# EAGLE design NDriveModule (EAGLE 6.5.0)
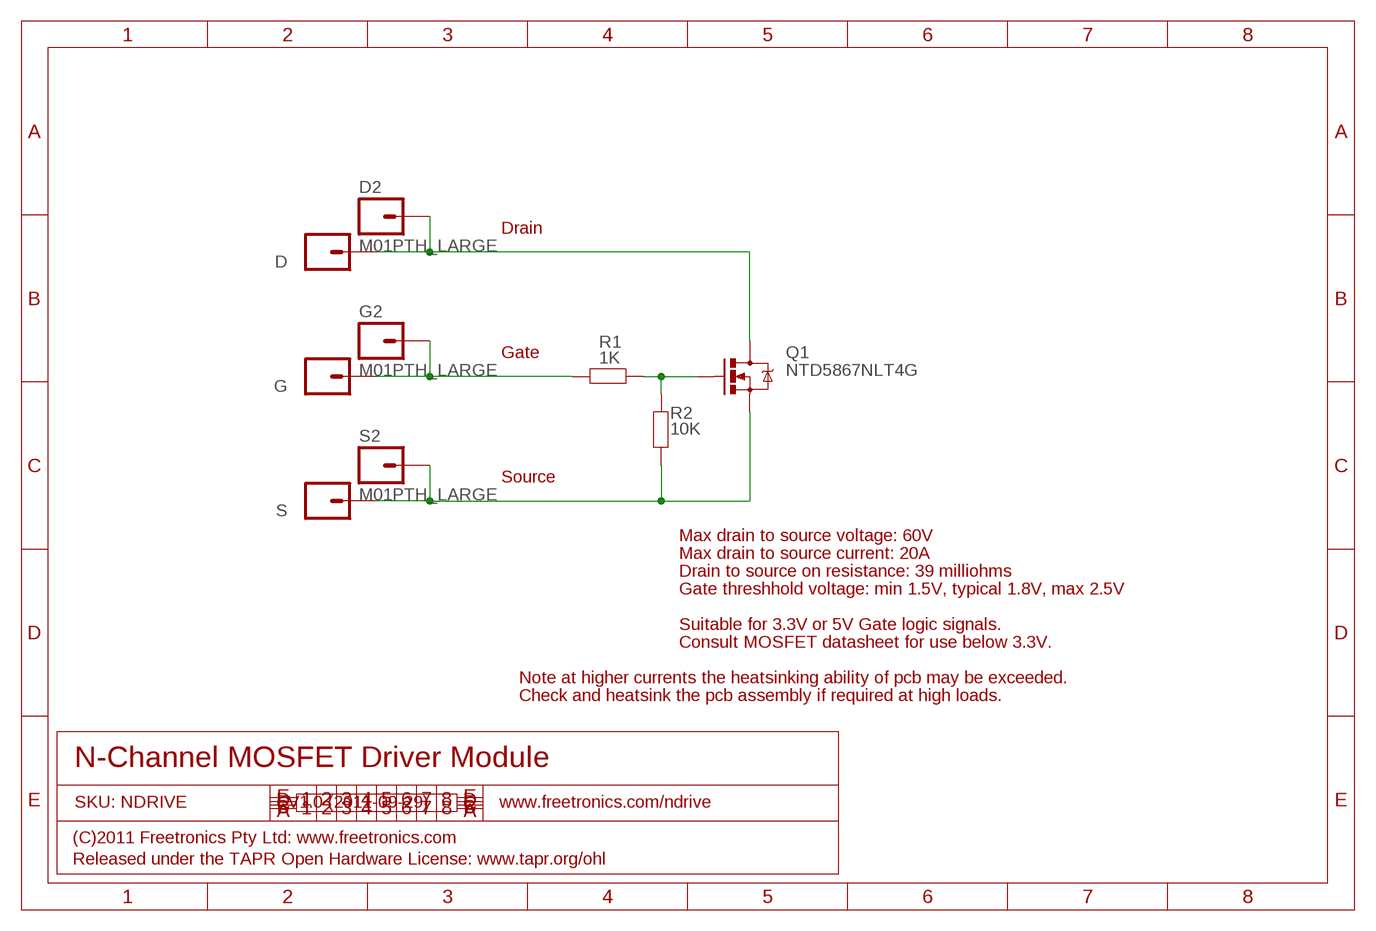
[diagram p0: schematic, sheet 1]

## Parts
D  M01PTH  [1X01]
D2  M01PTH_LARGE  [1X01LARGE]
G  M01PTH  [1X01]
G2  M01PTH_LARGE  [1X01LARGE]
Q1  NTD5867NLT4G  MOSFET-NCHANNELDPAK  [DPACK]
R1  1K  RESISTOR0603  [0603]
R2  10K  RESISTOR0603  [0603]
S  M01PTH  [1X01]
S2  M01PTH_LARGE  [1X01LARGE]

## Nets
D: D2.1 D.1 Q1.2(D)
G: G2.1 G.1 R1.2
N$3: Q1.1(G) R1.1 R2.2
S: Q1.3(S) R2.1 S2.1 S.1

## Notes on the sheet
- Drain
- Gate
- Source
- Max drain to source voltage: 60V
- Max drain to source current: 20A
- Drain to source on resistance: 39 milliohms
- Gate threshhold voltage: min 1.5V, typical 1.8V, max 2.5V
- Suitable for 3.3V or 5V Gate logic signals.
- Consult MOSFET datasheet for use below 3.3V.
- Note at higher currents the heatsinking ability of pcb may be exceeded.
- Check and heatsink the pcb assembly if required at high loads.
- N-Channel MOSFET Driver Module
- SKU: NDRIVE | V1.0 (2011-09-29) | www.freetronics.com/ndrive
- (C)2011 Freetronics Pty Ltd: www.freetronics.com
- Released under the TAPR Open Hardware License: www.tapr.org/ohl

## Library data of the parts
D G S = freetronics-master-v1:M01: Header 1 Standard 1-pin 0.1" header. Use with straight break away headers (SKU : PRT-00116), right angle break away headers (PRT-00553), swiss pins (PRT-00743), machine pins (PRT-00117), and female headers (PRT-00115).
D2 G2 S2 = freetronics-master-v1.1:M01: Header 1 Standard 1-pin 0.1" header. Use with straight break away headers (SKU : PRT-00116), right angle break away headers (PRT-00553), swiss pins (PRT-00743), machine pins (PRT-00117), and female headers (PRT-00115).
Q1 = freetronics-master-v1.1:MOSFET-NCHANNEL
R1 R2 = freetronics-master-v1:RESISTOR: Resistor Basic schematic elements and footprints for 0603, 1206, and PTH 1/10th watt (small) resistors.

## Board
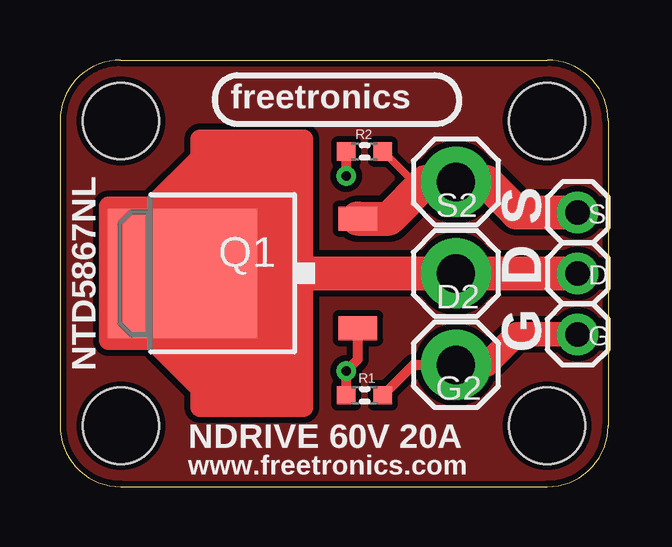
[diagram p1: board, top side]
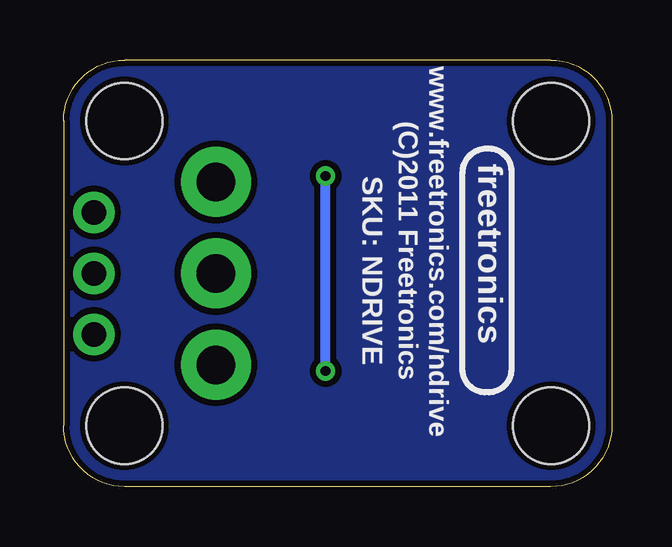
[diagram p2: board, bottom side, seen from below]

Size 22.86 x 17.78 mm. Coordinates in mm from the lower left corner, seen from the top.
Outline: 0,2.54 arc90 2.54,0 20.32,0 arc90 22.86,2.54 22.86,15.24 arc90 20.32,17.78 2.54,17.78 arc90 0,15.24 0,2.54
Copper layers (1*16): Top 0.035mm / dielectric 1.5mm / Bottom 0.035mm
Design rules "default *": minimum track width 8mil, minimum drill 15mil, track to track 10mil, track to pad 10mil, pad to pad 10mil, via to via 10mil, smd to smd 8mil, copper to edge 10mil, drill to drill 8mil, minimum pad ring 14mil, minimum via ring 8mil, stop-mask expansion 4mil, vias tented up to drill 25mil, thermal gap 10mil
Holes 3.17 mm at 2.54,2.54 20.32,2.54 2.54,15.24 20.32,15.24

### Footprints (pad centres in the part's own frame; a part is rotated, then mirrored left to right if it is on the bottom)
1X01 = drill 1.016 round: 1 0,0
1X01LARGE = drill 1.6 pad 2.921 round: 1 0,0
DPACK = smd 1 x 1.6: 1 -2.28,-4.8; 3 2.28,-4.8 | smd 5.4 x 6.2: 2 0,2.5
0603 = smd 0.762 x 0.762: 1 -0.762,0; 2 0.762,0

### Placement (x,y rotation side)
D  21.59,8.89 0 top
D2  16.51,8.89 0 top
G  21.59,6.35 0 top
G2  16.51,5.08 0 top
Q1  7.62,8.89 90 top
R1  12.7,3.81 0 top
R2  12.7,13.97 180 top
S  21.59,11.43 0 top
S2  16.51,12.7 0 top

### Tracks (layer width: path | path; a pad name or v marks a point on that pad's centre or on a via)
D
  Top 0.813: 5.84,13.72 3.81,11.68 2.03,11.68 2.03,6.1 3.81,6.1 5.84,4.06 5.84,3.3 10.16,3.3 10.16,14.48 5.84,14.48 5.84,13.72 | 7.37,13.72 9.65,13.72 9.65,3.56 8.89,3.56 8.89,13.97 8.13,13.97 8.13,3.3 7.37,3.3 7.37,13.72 | 6.6,13.72 7.37,13.72 | 6.6,13.72 6.35,13.46 6.6,13.46 6.6,3.56 6.1,3.56 6.1,13.21 5.33,12.45 5.33,4.83 4.57,5.59 4.57,11.94 3.81,11.18 3.81,10.67 | 3.81,10.67 3.81,6.35 3.05,6.35 3.05,11.18 3.3,11.43 2.29,11.43 2.29,6.35 | Q1.2 5.12,9.36 3.81,10.67 | 6.6,13.72 5.84,13.72
  Top 1.422: D.1 D2.1 Q1.2
G
  Top 0.406: G2.1 14.73,5.08 R1.2
  Top 1.016: G2.1 17.78,5.08 19.05,6.35 G.1
GND
  pour Top (no thermals): 0,15.24 0,2.54 arc90 2.54,0 20.32,0 arc90 22.86,2.54 22.86,15.24 arc90 20.32,17.78 2.54,17.78 arc90
  pour Bottom: 2.54,17.78 arc90 0,15.24 0,2.54 arc90 2.54,0 20.32,0 arc90 22.86,2.54 22.86,15.24 arc90 20.32,17.78
N$3  (via drill 0.4)
  Top 0.406: 12.45,6.58 Q1.1 12.42,5.31 v11.94,4.83 R1.1 | v11.94,12.95 R2.2
  Bottom 0.406: v11.94,4.83 v11.94,12.95
S
  Top 0.305: R2.1 14.73,12.7 15.24,12.7
  Top 1.422: S.1 19.05,11.43 17.78,12.7 S2.1 15.24,12.7 13.71,11.17 Q1.3

### Text on the board
tPlace: freetronics | S | D | G | NTD5867NL | NDRIVE 60V 20A | www.freetronics.com
bPlace: www.freetronics.com/ndrive | (C)2011 Freetronics | freetronics | SKU: NDRIVE